# EasyEDA schematic SCH_usb-usb_2025-03-20.json
TITLE: Sheet_1; REV: 1.0; Date: 2025-02-07; Sheet: 1/1; Drawn By: pgomila20959; Company: Pau Gomila Barber
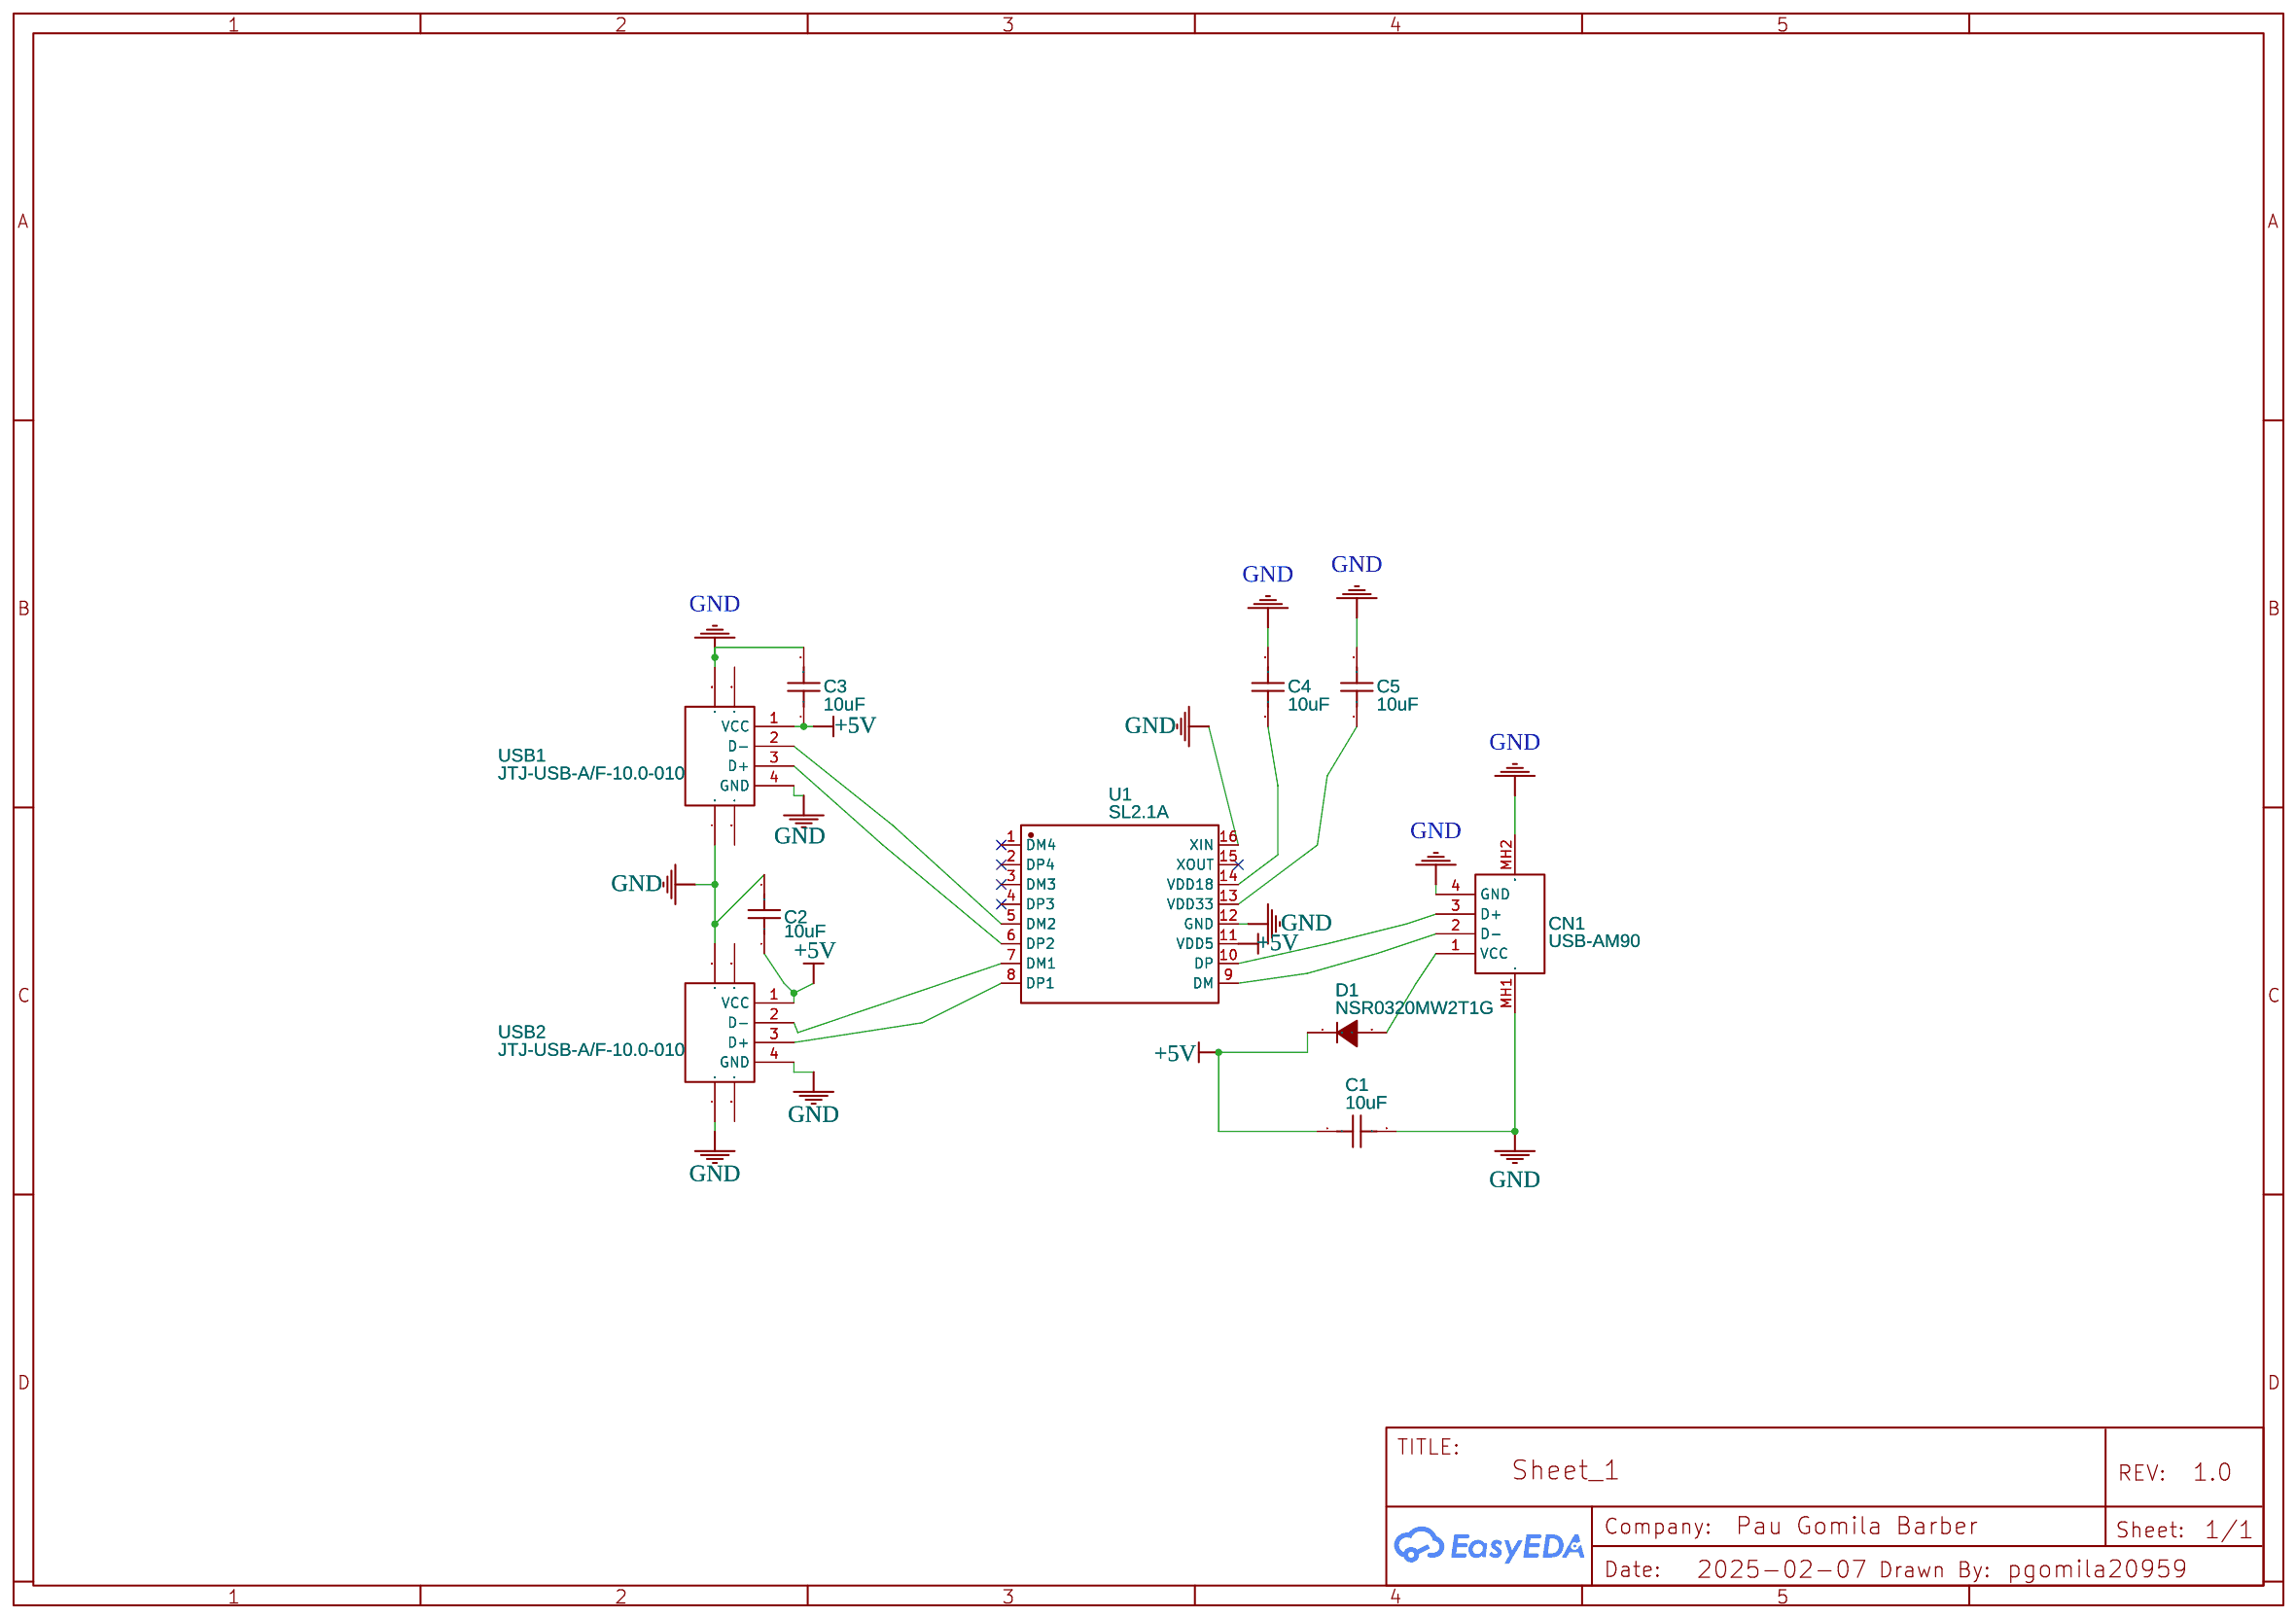
[diagram p0: schematic sheet]

## Parts
C1  10uF  [C0603]
C2  10uF  [C0603]
C3  10uF  [C0603]
C4  10uF  [C0603]
C5  10uF  [C0603]
CN1  USB-AM90  [USB-A-TH_AM90]
D1  NSR0320MW2T1G  [SOD-323_L1.8-W1.3-LS2.5-RD]
U1  SL2.1A  [SOP-16_L10.0-W3.9-P1.27-LS6.0-BL]
USB1  JTJ-USB-A/F-10.0-010  [USB-A-TH_JTJ-USB-A-F-10.0-010]
USB2  JTJ-USB-A/F-10.0-010  [USB-A-TH_JTJ-USB-A-F-10.0-010]

## Library data of the parts
C1-C5 = CL10A106KP8NNNC: Supplier: LCSC; Manufacturer: SAMSUNG(三星); Supplier Part: C19702; JLCPCB Part Class: Basic Part
CN1 = USB-AM90: Supplier Part: C46395; Supplier: LCSC; Manufacturer: ValuePro
D1 = NSR0320MW2T1G: Supplier: LCSC; Manufacturer: onsemi(安森美); Supplier Part: C48192; JLCPCB Part Class: Extended Part
U1 = SL2.1A: Contributor: LCSC; Supplier: LCSC; Supplier Part: C192893; Manufacturer: CoreChips(和芯润德); JLCPCB Part Class: Extended Part
USB1 USB2 = JTJ-USB-A/F-10.0-010: Supplier: LCSC; Manufacturer: 精拓金; Manufacturer Part: 908-371A1011D10100; Supplier Part: C42576; JLCPCB Part Class: Extended Part

## Nets
+5V: C1.1 C2.1 C3.1 D1.1(C) U1.11(VDD5) USB1.1(VCC) USB2.1(VCC)
GND: C1.2 C2.2 C3.2 C4.2 C5.2 CN1.4(GND) CN1.MH1 CN1.MH2 U1.12(GND) U1.16(XIN) USB1.4(GND) USB1.6(0) USB1.7(0) USB2.4(GND) USB2.6(0) USB2.7(0)
Net-(C4-1): C4.1 U1.14(VDD18)
Net-(C5-1): C5.1 U1.13(VDD33)
Net-(CN1-1): CN1.1(VCC) D1.2(A)
Net-(CN1-2): CN1.2(D-) U1.9(DM)
Net-(CN1-3): CN1.3(D+) U1.10(DP)
Net-(U1-5): U1.5(DM2) USB1.2(D-)
Net-(U1-6): U1.6(DP2) USB1.3(D+)
Net-(U1-7): U1.7(DM1) USB2.2(D-)
Net-(U1-8): U1.8(DP1) USB2.3(D+)

Not connected (* = marked no-connect by the designer): U1 1(DM4)* 2(DP4)* 3(DM3)* 4(DP3)* 15(XOUT)*; USB1 5(0) 8(0); USB2 5(0) 8(0)
